# Altium project LED_SHIELD_MOTOR_CONTROLLER_V2.PrjPcb
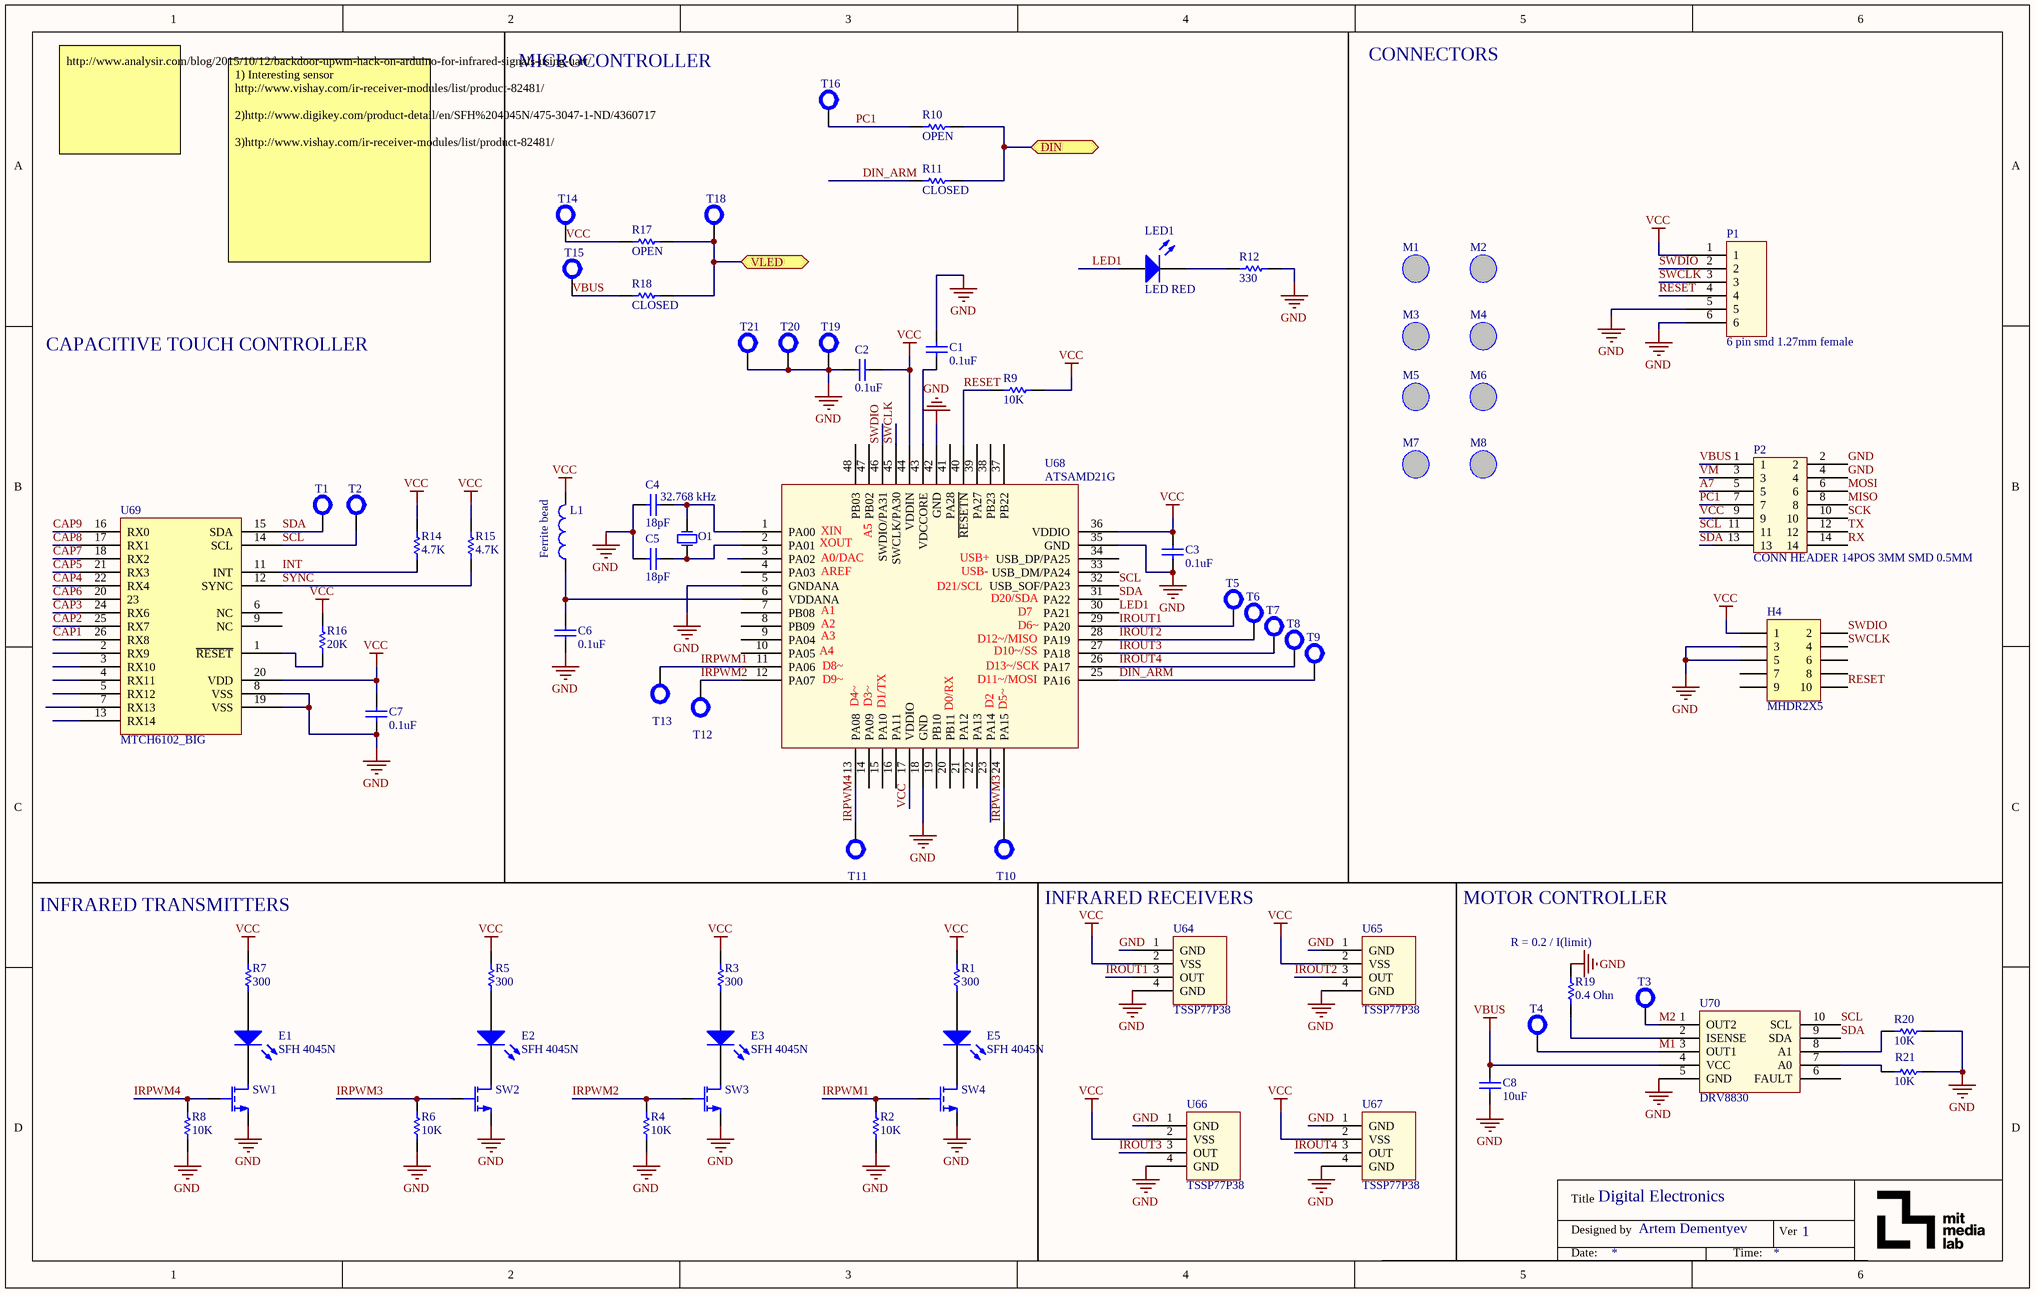
[diagram p0: Schematic_LED_SHIELD_DIGITAL.SchDoc]
2 sheets, 140 parts. Net scope: flat (ports and power ports of the same name join across sheets).
Board file: PCB_LED_SHIELD_MOTOR_CONTROLLER_V2.PcbDoc
Sheets:
  Schematic_LED_SHIELD_DIGITAL.SchDoc
  Schematic_LED_SHIELD_MOTOR_CONTROLLER_V2.SchDoc

## Sheet Schematic_LED_SHIELD_DIGITAL.SchDoc: Digital Electronics
size B; Author: Artem Dementyev; DrawnBy: Artem Dementyev; Engineer: Artem Dementyev; Revision: 1

### Parts
C1  0.1uF  [0603W]
C2  0.1uF  [0603W]
C3  0.1uF  [0603W]
C4  18pF  [0603W]
C5  18pF  [0603W]
C6  0.1uF  [0603W]
C7  0.1uF  [0603W]
C8  10uF  [0603W]
E1  SFH 4045N  [SFH 4045N]
E2  SFH 4045N  [SFH 4045N]
E3  SFH 4045N  [SFH 4045N]
E5  SFH 4045N  [SFH 4045N]
H4  MHDR2X5  [MHDR2X5]
L1  Ferrite bead  [0603W]
LED1  LED RED  [0603W]
M1  Custom_magnet_holder  [3mm_magnet_holder]  (value not drawn)
M2  Custom_magnet_holder  [3mm_magnet_holder]  (value not drawn)
M3  Custom_magnet_holder  [3mm_magnet_holder]  (value not drawn)
M4  Custom_magnet_holder  [3mm_magnet_holder]  (value not drawn)
M5  Custom_magnet_holder  [3mm_magnet_holder]  (value not drawn)
M6  Custom_magnet_holder  [3mm_magnet_holder]  (value not drawn)
M7  Custom_magnet_holder  [3mm_magnet_holder]  (value not drawn)
M8  Custom_magnet_holder  [3mm_magnet_holder]  (value not drawn)
O1  32.768 kHz  [32.768 Crystal]
P1  6 pin smd 1.27mm female  [6pos 1.27mm]
P2  CONN HEADER 14POS 3MM SMD 0.5MM  [DF12 14Pos Female]
R1  300  [0603W]
R2  10K  [0603W]
R3  300  [0603W]
R4  10K  [0603W]
R5  300  [0603W]
R6  10K  [0603W]
R7  300  [0603W]
R8  10K  [0603W]
R9  10K  [0603W]
R10  OPEN  [0603W]
R11  CLOSED  [0603W]
R12  330  [0603W]
R14  4.7K  [0603W]
R15  4.7K  [0603W]
R16  20K  [0603W]
R17  OPEN  [0603W]
R18  CLOSED  [0603W]
R19  0.4 Ohn  [0603W]
R20  10K  [0603W]
R21  10K  [0603W]
SW1  MOSFET N CHANNEL  [SOT323]  (value not drawn)
SW2  MOSFET N CHANNEL  [SOT323]  (value not drawn)
SW3  MOSFET N CHANNEL  [SOT323]  (value not drawn)
SW4  MOSFET N CHANNEL  [SOT323]  (value not drawn)
T1  Test point small  [TEST POINT SMD SUPER SMALL]  (value not drawn)
T2  Test point small  [TEST POINT SMD SUPER SMALL]  (value not drawn)
T3  Test point small  [TEST POINT SMD SUPER SMALL]  (value not drawn)
T4  Test point small  [TEST POINT SMD SUPER SMALL]  (value not drawn)
T5  Test point small  [TEST POINT SMD SUPER SMALL]  (value not drawn)
T6  Test point small  [TEST POINT SMD SUPER SMALL]  (value not drawn)
T7  Test point small  [TEST POINT SMD SUPER SMALL]  (value not drawn)
T8  Test point small  [TEST POINT SMD SUPER SMALL]  (value not drawn)
T9  Test point small  [TEST POINT SMD SUPER SMALL]  (value not drawn)
T10  Test point small  [TEST POINT SMD SUPER SMALL]  (value not drawn)
T11  Test point small  [TEST POINT SMD SUPER SMALL]  (value not drawn)
T12  Test point small  [TEST POINT SMD SUPER SMALL]  (value not drawn)
T13  Test point small  [TEST POINT SMD SUPER SMALL]  (value not drawn)
T14  Test point small  [TEST POINT SMD SUPER SMALL]  (value not drawn)
T15  Test point small  [TEST POINT SMD SUPER SMALL]  (value not drawn)
T16  Test point small  [TEST POINT SMD SUPER SMALL]  (value not drawn)
T18  Test point small  [TEST POINT SMD SUPER SMALL]  (value not drawn)
T19  Test point small  [TEST POINT SMD SUPER SMALL]  (value not drawn)
T20  Test point small  [TEST POINT SMD SUPER SMALL]  (value not drawn)
T21  Test point small  [TEST POINT SMD SUPER SMALL]  (value not drawn)
U64  TSSP77P38  [TSSP77P38]
U65  TSSP77P38  [TSSP77P38]
U66  TSSP77P38  [TSSP77P38]
U67  TSSP77P38  [TSSP77P38]
U68  ATSAMD21G  [TQFN48]
U69  MTCH6102_BIG  [SS28]
U70  DRV8830  [MSOP10_TI_POWERPAD]

### Ports
DIN, VLED

### Nets
GND: C1.2 C2.2 C3.1 C4.2 C5.2 C6.1 C7.1 C8.1 H4.3 H4.5 P1.5 P1.6 P2.2 P2.4 R2.2 R4.2 R6.2 R8.2 R12.1 R19.1 R20.2 R21.2 SW1.2(S) SW2.2(S) SW3.2(S) SW4.2(S) T19.0 T20.0 T21.0 U64.1(GND) U64.4(GND) U65.1(GND) U65.4(GND) U66.1(GND) U66.4(GND) U67.1(GND) U67.4(GND) U68.5(GNDANA) U68.18(GND) U68.35(GND) U68.42(GND) U69.8(VSS) U69.19(VSS) U70.5(GND)
VBUS: C8.2 P2.1 R18.2 T15.0 U70.4(VCC)
VCC: C2.1 C3.2 C7.2 H4.1 L1.2 P1.1 P2.9 R1.1 R3.1 R5.1 R7.1 R9.1 R14.2 R15.2 R16.1 R17.2 T14.0 U64.2(VSS) U65.2(VSS) U66.2(VSS) U67.2(VSS) U68.17(VDDIO) U68.36(VDDIO) U68.44(VDDIN) U69.20(VDD)
A7: P2.5
CAP1: U69.26(RX8)
CAP2: U69.25(RX7)
CAP3: U69.24(RX6)
CAP4: U69.22(RX4)
CAP5: U69.21(RX3)
CAP6: U69.20(23)
CAP7: U69.18(RX2)
CAP8: U69.17(RX1)
CAP9: U69.16(RX0)
DIN_ARM: R11.2 T9.0 U68.25(PA16)
INT: R14.1 U69.11(INT)
IROUT1: T5.0 U64.3(OUT) U68.29(PA20)
IROUT2: T6.0 U65.3(OUT) U68.28(PA19)
IROUT3: T7.0 U66.3(OUT) U68.27(PA18)
IROUT4: T8.0 U67.3(OUT) U68.26(PA17)
IRPWM1: R2.1 SW4.1(G) T13.0 U68.11(PA06)
IRPWM2: R4.1 SW3.1(G) T12.0 U68.12(PA07)
IRPWM3: R6.1 SW2.1(G) T10.0 U68.24(PA15)
IRPWM4: R8.1 SW1.1(G) T11.0 U68.13(PA08)
LED1: LED1.1(A) U68.30(PA21)
M1: T4.0 U70.3(OUT1)
M2: T3.0 U70.1(OUT2)
MISO: P2.8
MOSI: P2.6
PC1: P2.7 R10.2 T16.0
RESET: H4.10 P1.4 R9.2 U68.40(~{RESETN})
RX: P2.14
SCK: P2.10
SCL: P2.11 T2.0 U68.32(USB_SOF/PA23) U69.14(SCL) U70.10(SCL)
SDA: P2.13 T1.0 U68.31(PA22) U69.15(SDA) U70.9(SDA)
SWCLK: H4.4 P1.3 U68.45(SWCLK/PA30)
SWDIO: H4.2 P1.2 U68.46(SWDIO/PA31)
SYNC: R15.1 U69.12(SYNC)
TX: P2.12
VM: P2.3
NetC1_1: C1.1 U68.43(VDCCORE)
NetC4_1: C4.1 O1.1 U68.1(PA00)
NetC5_1: C5.1 O1.2 U68.2(PA01)
NetC6_2: C6.2 L1.1 U68.6(VDDANA)
NetE1_1: E1.1(Cathode) SW1.3(D)
NetE1_2: E1.2(Anode) R7.2
NetE2_1: E2.1(Cathode) SW2.3(D)
NetE2_2: E2.2(Anode) R5.2
NetE3_1: E3.1(Cathode) SW3.3(D)
NetE3_2: E3.2(Anode) R3.2
NetE5_1: E5.1(Cathode) SW4.3(D)
NetE5_2: E5.2(Anode) R1.2
NetLED1_2: LED1.2(K) R12.2
NetR10_1: R10.1 R11.1 ; port DIN
NetR16_2: R16.2 U69.1(~{RESET})
NetR17_1: R17.1 R18.1 T18.0 ; port VLED
NetR19_2: R19.2 U70.2(ISENSE)
NetR20_1: R20.1 U70.8(A1)
NetR21_1: R21.1 U70.7(A0)

Not connected (* = marked no-connect by the designer): H4 6 7 8 9; U68 3(PA02) 4(PA03) 7(PB08) 8(PB09) 9(PA04) 10(PA05) 14(PA09) 15(PA10) 16(PA11) 19(PB10) 20(PB11) 21(PA12) 22(PA13) 23(PA14) 33(USB_DM/PA24) 34(USB_DP/PA25) 37(PB22) 38(PB23) 39(PA27) 41(PA28) 47(PB02) 48(PB03); U69 2(RX9) 3(RX10) 4(RX11) 5(RX12) 6(NC) 7(RX13) 9(NC) 13(RX14); U70 6(FAULT)

### Notes on the sheet
- MICROCONTROLLER
- CONNECTORS
- http://www.analysir.com/blog/2015/10/12/backdoor-upwm-hack-on-arduino-for-infrared-signals-using-uart/
- 1) Interesting sensor http://www.vishay.com/ir-receiver-modules/list/product-82481/
  2)http://www.digikey.com/product-detail/en/SFH%204045N/475-3047-1-ND/4360717
  3)http://www.vishay.com/ir-receiver-modules/list/product-82481/
- CAPACITIVE TOUCH CONTROLLER
- (near R7) INFRARED TRANSMITTERS
- INFRARED RECEIVERS
- MOTOR CONTROLLER
- (near R19) R = 0.2 / I(limit)
- Title
- Designed by
- Ver
- Date:
- Time:
- (in symbol ATSAMD21G) XIN; A5; XOUT; A0/DAC; USB+; AREF; USB-; D21/SCL; D20/SDA; A1; D7; A2; D6~; A3; D12~/MISO; A4; D10~/SS; D8~; D13~/SCK; D9~; D11~/MOSI; D4~; D3~; D1/TX; D2; D5~; D0/RX

### Library data of the parts
C1-C8 = Capacitor: SMD Cap 1206
  C7: digikey number: 1276-1443-1-ND
E1-E3 E5 = SFH 4045N: High Power Infrared Emitter (940 nm); digikey part number: 475-3047-1-ND
H4 = MHDR2X5: Header, 5-Pin, Dual row; LatestRevisionDate: 17-Jul-2002; LatestRevisionNote: Re-released for DXP Platform.; Publisher: Altium Limited
L1 = INDUCTOR Low DCR: Digikey: 490-5223-2-ND
LED1 = LED: LED SMD 1206/0603; Sparkfun green: PRT-12622; Sparkfun blue: PRT-12620
O1 = 32.768 Crystal: digikey number: XC1617CT-ND
R1-R12 R14-R21 = Resistor
  R12: digikey number: RMCF0603FT10K0CT-ND
  R14 R15: digikey number: 311-4.7KJRCT-ND
  R16: digikey number: P20.0KLCT-ND
U64-U67 = TSSP77P38: IR Detector for Mid Range Proximity Sensor; digikey part number: TSSP77P38TCT-ND
U68 = ATSAMD21G: IC MCU 32BIT 256KB FLASH 48TQFP; digikey part number: ATSAMD21G18A-AUTCT-ND
U70 = DRV8830: Low-Voltage Motor Driver With Serial Interface; digikey part number: 296-28165-1-ND
P1 = 6 pin smd 1.27mm female: digikey: S9005E-06-ND
P2 = CONN HEADER 14POS 3MM SMD 0.5MM: digikey part number: H11701TR-ND; digikey part number female: H11701TR-ND
SW1-SW4 = MOSFET N CHANNEL: digikey part number: 568-5987-1-ND
T1-T16 T18-T21 = Test point small: digikey number: 5000K-ND

## Sheet Schematic_LED_SHIELD_MOTOR_CONTROLLER_V2.SchDoc: LED SHIELD
size B; Author: Artem Dementyev; DrawnBy: Artem Dementyev; Revision: 1
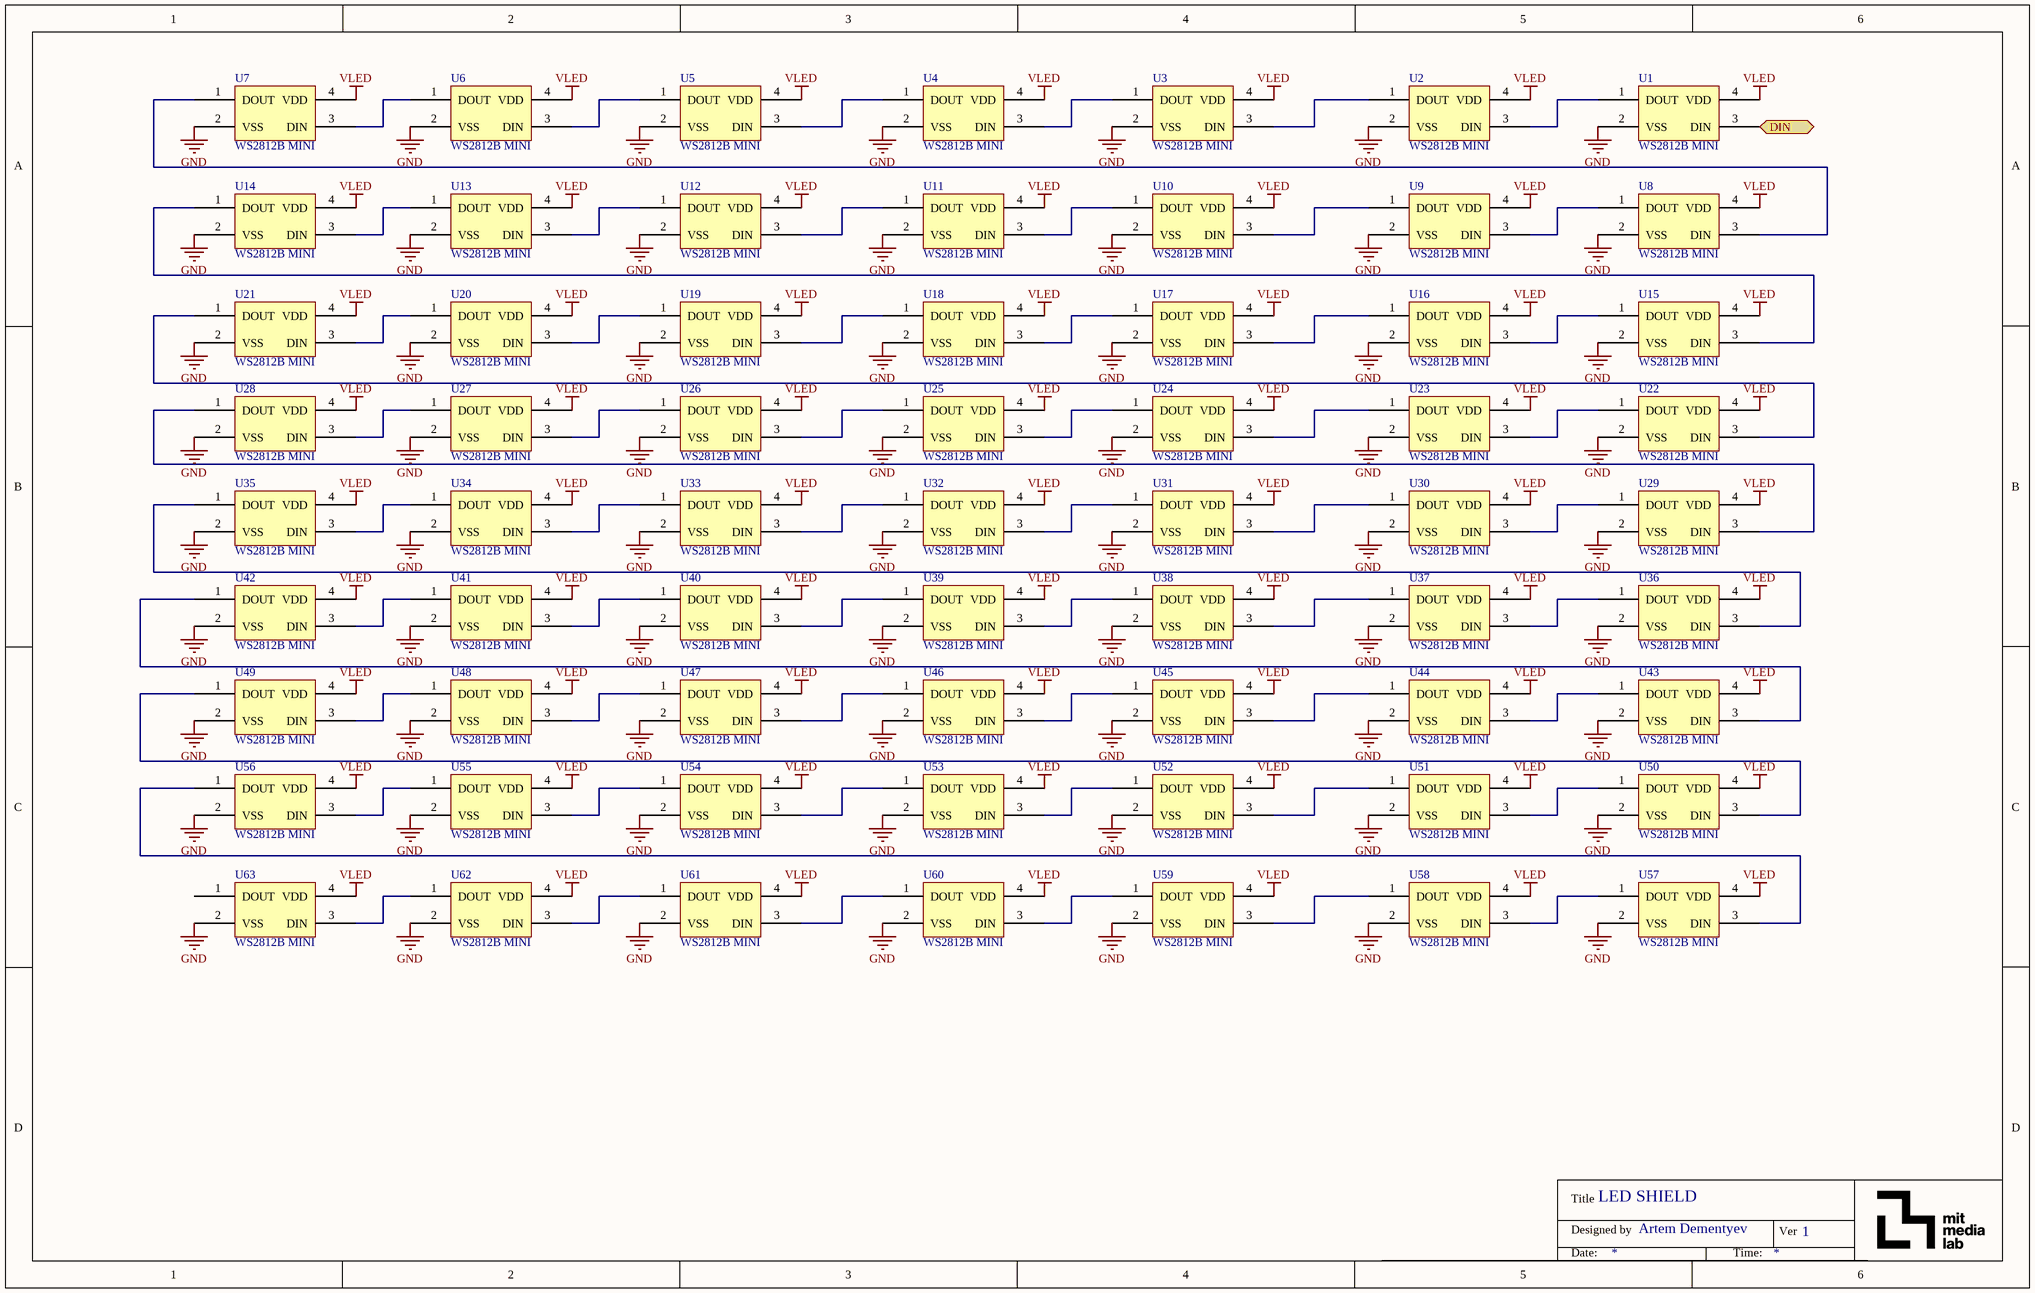
[diagram p1: Schematic_LED_SHIELD_MOTOR_CONTROLLER_V2.SchDoc]

### Parts
U1  WS2812B MINI  [WS2812B MINI]
U2  WS2812B MINI  [WS2812B MINI]
U3  WS2812B MINI  [WS2812B MINI]
U4  WS2812B MINI  [WS2812B MINI]
U5  WS2812B MINI  [WS2812B MINI]
U6  WS2812B MINI  [WS2812B MINI]
U7  WS2812B MINI  [WS2812B MINI]
U8  WS2812B MINI  [WS2812B MINI]
U9  WS2812B MINI  [WS2812B MINI]
U10  WS2812B MINI  [WS2812B MINI]
U11  WS2812B MINI  [WS2812B MINI]
U12  WS2812B MINI  [WS2812B MINI]
U13  WS2812B MINI  [WS2812B MINI]
U14  WS2812B MINI  [WS2812B MINI]
U15  WS2812B MINI  [WS2812B MINI]
U16  WS2812B MINI  [WS2812B MINI]
U17  WS2812B MINI  [WS2812B MINI]
U18  WS2812B MINI  [WS2812B MINI]
U19  WS2812B MINI  [WS2812B MINI]
U20  WS2812B MINI  [WS2812B MINI]
U21  WS2812B MINI  [WS2812B MINI]
U22  WS2812B MINI  [WS2812B MINI]
U23  WS2812B MINI  [WS2812B MINI]
U24  WS2812B MINI  [WS2812B MINI]
U25  WS2812B MINI  [WS2812B MINI]
U26  WS2812B MINI  [WS2812B MINI]
U27  WS2812B MINI  [WS2812B MINI]
U28  WS2812B MINI  [WS2812B MINI]
U29  WS2812B MINI  [WS2812B MINI]
U30  WS2812B MINI  [WS2812B MINI]
U31  WS2812B MINI  [WS2812B MINI]
U32  WS2812B MINI  [WS2812B MINI]
U33  WS2812B MINI  [WS2812B MINI]
U34  WS2812B MINI  [WS2812B MINI]
U35  WS2812B MINI  [WS2812B MINI]
U36  WS2812B MINI  [WS2812B MINI]
U37  WS2812B MINI  [WS2812B MINI]
U38  WS2812B MINI  [WS2812B MINI]
U39  WS2812B MINI  [WS2812B MINI]
U40  WS2812B MINI  [WS2812B MINI]
U41  WS2812B MINI  [WS2812B MINI]
U42  WS2812B MINI  [WS2812B MINI]
U43  WS2812B MINI  [WS2812B MINI]
U44  WS2812B MINI  [WS2812B MINI]
U45  WS2812B MINI  [WS2812B MINI]
U46  WS2812B MINI  [WS2812B MINI]
U47  WS2812B MINI  [WS2812B MINI]
U48  WS2812B MINI  [WS2812B MINI]
U49  WS2812B MINI  [WS2812B MINI]
U50  WS2812B MINI  [WS2812B MINI]
U51  WS2812B MINI  [WS2812B MINI]
U52  WS2812B MINI  [WS2812B MINI]
U53  WS2812B MINI  [WS2812B MINI]
U54  WS2812B MINI  [WS2812B MINI]
U55  WS2812B MINI  [WS2812B MINI]
U56  WS2812B MINI  [WS2812B MINI]
U57  WS2812B MINI  [WS2812B MINI]
U58  WS2812B MINI  [WS2812B MINI]
U59  WS2812B MINI  [WS2812B MINI]
U60  WS2812B MINI  [WS2812B MINI]
U61  WS2812B MINI  [WS2812B MINI]
U62  WS2812B MINI  [WS2812B MINI]
U63  WS2812B MINI  [WS2812B MINI]

### Ports
DIN

### Nets
GND: U1.2(VSS) U2.2(VSS) U3.2(VSS) U4.2(VSS) U5.2(VSS) U6.2(VSS) U7.2(VSS) U8.2(VSS) U9.2(VSS) U10.2(VSS) U11.2(VSS) U12.2(VSS) U13.2(VSS) U14.2(VSS) U15.2(VSS) U16.2(VSS) U17.2(VSS) U18.2(VSS) U19.2(VSS) U20.2(VSS) U21.2(VSS) U22.2(VSS) U23.2(VSS) U24.2(VSS) U25.2(VSS) U26.2(VSS) U27.2(VSS) U28.2(VSS) U29.2(VSS) U30.2(VSS) U31.2(VSS) U32.2(VSS) U33.2(VSS) U34.2(VSS) U35.2(VSS) U36.2(VSS) U37.2(VSS) U38.2(VSS) U39.2(VSS) U40.2(VSS) U41.2(VSS) U42.2(VSS) U43.2(VSS) U44.2(VSS) U45.2(VSS) U46.2(VSS) U47.2(VSS) U48.2(VSS) U49.2(VSS) U50.2(VSS) U51.2(VSS) U52.2(VSS) U53.2(VSS) U54.2(VSS) U55.2(VSS) U56.2(VSS) U57.2(VSS) U58.2(VSS) U59.2(VSS) U60.2(VSS) U61.2(VSS) U62.2(VSS) U63.2(VSS)
VLED: U1.4(VDD) U2.4(VDD) U3.4(VDD) U4.4(VDD) U5.4(VDD) U6.4(VDD) U7.4(VDD) U8.4(VDD) U9.4(VDD) U10.4(VDD) U11.4(VDD) U12.4(VDD) U13.4(VDD) U14.4(VDD) U15.4(VDD) U16.4(VDD) U17.4(VDD) U18.4(VDD) U19.4(VDD) U20.4(VDD) U21.4(VDD) U22.4(VDD) U23.4(VDD) U24.4(VDD) U25.4(VDD) U26.4(VDD) U27.4(VDD) U28.4(VDD) U29.4(VDD) U30.4(VDD) U31.4(VDD) U32.4(VDD) U33.4(VDD) U34.4(VDD) U35.4(VDD) U36.4(VDD) U37.4(VDD) U38.4(VDD) U39.4(VDD) U40.4(VDD) U41.4(VDD) U42.4(VDD) U43.4(VDD) U44.4(VDD) U45.4(VDD) U46.4(VDD) U47.4(VDD) U48.4(VDD) U49.4(VDD) U50.4(VDD) U51.4(VDD) U52.4(VDD) U53.4(VDD) U54.4(VDD) U55.4(VDD) U56.4(VDD) U57.4(VDD) U58.4(VDD) U59.4(VDD) U60.4(VDD) U61.4(VDD) U62.4(VDD) U63.4(VDD)
NetR10_1: U1.3(DIN) ; port DIN
NetU1_1: U1.1(DOUT) U2.3(DIN)
NetU2_1: U2.1(DOUT) U3.3(DIN)
NetU3_1: U3.1(DOUT) U4.3(DIN)
NetU4_1: U4.1(DOUT) U5.3(DIN)
NetU5_1: U5.1(DOUT) U6.3(DIN)
NetU6_1: U6.1(DOUT) U7.3(DIN)
NetU7_1: U7.1(DOUT) U8.3(DIN)
NetU8_1: U8.1(DOUT) U9.3(DIN)
NetU9_1: U9.1(DOUT) U10.3(DIN)
NetU10_1: U10.1(DOUT) U11.3(DIN)
NetU11_1: U11.1(DOUT) U12.3(DIN)
NetU12_1: U12.1(DOUT) U13.3(DIN)
NetU13_1: U13.1(DOUT) U14.3(DIN)
NetU14_1: U14.1(DOUT) U15.3(DIN)
NetU15_1: U15.1(DOUT) U16.3(DIN)
NetU16_1: U16.1(DOUT) U17.3(DIN)
NetU17_1: U17.1(DOUT) U18.3(DIN)
NetU18_1: U18.1(DOUT) U19.3(DIN)
NetU19_1: U19.1(DOUT) U20.3(DIN)
NetU20_1: U20.1(DOUT) U21.3(DIN)
NetU21_1: U21.1(DOUT) U22.3(DIN)
NetU22_1: U22.1(DOUT) U23.3(DIN)
NetU23_1: U23.1(DOUT) U24.3(DIN)
NetU24_1: U24.1(DOUT) U25.3(DIN)
NetU25_1: U25.1(DOUT) U26.3(DIN)
NetU26_1: U26.1(DOUT) U27.3(DIN)
NetU27_1: U27.1(DOUT) U28.3(DIN)
NetU28_1: U28.1(DOUT) U29.3(DIN)
NetU29_1: U29.1(DOUT) U30.3(DIN)
NetU30_1: U30.1(DOUT) U31.3(DIN)
NetU31_1: U31.1(DOUT) U32.3(DIN)
NetU32_1: U32.1(DOUT) U33.3(DIN)
NetU33_1: U33.1(DOUT) U34.3(DIN)
NetU34_1: U34.1(DOUT) U35.3(DIN)
NetU35_1: U35.1(DOUT) U36.3(DIN)
NetU36_1: U36.1(DOUT) U37.3(DIN)
NetU37_1: U37.1(DOUT) U38.3(DIN)
NetU38_1: U38.1(DOUT) U39.3(DIN)
NetU39_1: U39.1(DOUT) U40.3(DIN)
NetU40_1: U40.1(DOUT) U41.3(DIN)
NetU41_1: U41.1(DOUT) U42.3(DIN)
NetU42_1: U42.1(DOUT) U43.3(DIN)
NetU43_1: U43.1(DOUT) U44.3(DIN)
NetU44_1: U44.1(DOUT) U45.3(DIN)
NetU45_1: U45.1(DOUT) U46.3(DIN)
NetU46_1: U46.1(DOUT) U47.3(DIN)
NetU47_1: U47.1(DOUT) U48.3(DIN)
NetU48_1: U48.1(DOUT) U49.3(DIN)
NetU49_1: U49.1(DOUT) U50.3(DIN)
NetU50_1: U50.1(DOUT) U51.3(DIN)
NetU51_1: U51.1(DOUT) U52.3(DIN)
NetU52_1: U52.1(DOUT) U53.3(DIN)
NetU53_1: U53.1(DOUT) U54.3(DIN)
NetU54_1: U54.1(DOUT) U55.3(DIN)
NetU55_1: U55.1(DOUT) U56.3(DIN)
NetU56_1: U56.1(DOUT) U57.3(DIN)
NetU57_1: U57.1(DOUT) U58.3(DIN)
NetU58_1: U58.1(DOUT) U59.3(DIN)
NetU59_1: U59.1(DOUT) U60.3(DIN)
NetU60_1: U60.1(DOUT) U61.3(DIN)
NetU61_1: U61.1(DOUT) U62.3(DIN)
NetU62_1: U62.1(DOUT) U63.3(DIN)

Not connected (* = marked no-connect by the designer): U63 1(DOUT)

### Notes on the sheet
- Title
- Designed by
- Ver
- Date:
- Time:

## Nets that join several sheets
GND: Schematic_LED_SHIELD_DIGITAL (44 pins), Schematic_LED_SHIELD_MOTOR_CONTROLLER_V2 (63 pins)
NetR10_1: Schematic_LED_SHIELD_DIGITAL (R10.1 R11.1), Schematic_LED_SHIELD_MOTOR_CONTROLLER_V2 (U1.3)